# Altium schematic sheet tempmux.SchDoc
size A
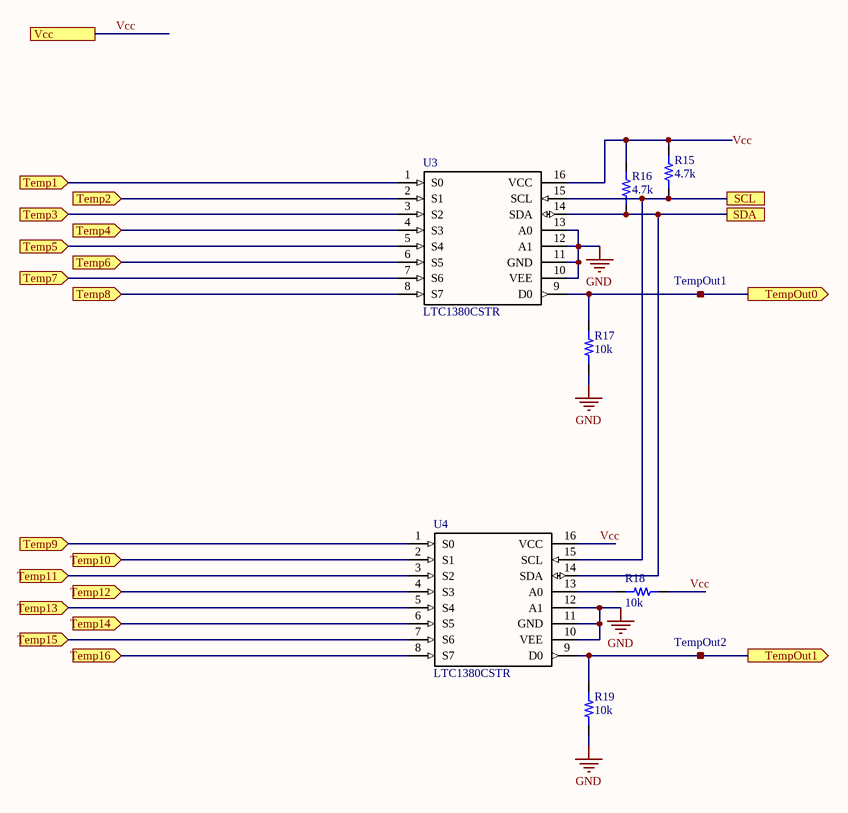
[diagram p0: tempmux.SchDoc]

## Parts
R15  4.7k  [RES 0603/1608]
R16  4.7k  [RES 0603/1608]
R17  10k  [RES 0603/1608]
R18  10k  [RES 0603/1608]
R19  10k  [RES 0603/1608]
TempOut1  RCU-0C  [RCU-0C]  (value not drawn)
TempOut2  RCU-0C  [RCU-0C]  (value not drawn)
U3  LTC1380CSTR  [LTC1380CSTR]
U4  LTC1380CSTR  [LTC1380CSTR]

## Ports
SCL, SDA, Temp1 (in), Temp2 (in), Temp3 (in), Temp4 (in), Temp5 (in), Temp6 (in), Temp7 (in), Temp8 (in), Temp9 (in), Temp10 (in), Temp11 (in), Temp12 (in), Temp13 (in), Temp14 (in), Temp15 (in), Temp16 (in), TempOut0 (out), TempOut1 (out), Vcc

## Nets
GND: R17.1 R19.1 U3.10(VEE) U3.11(GND) U3.12(A1) U3.13(A0) U4.10(VEE) U4.11(GND) U4.12(A1)
SCL: R15.1 U3.15(SCL) U4.15(SCL) ; port SCL
SDA: R16.1 U3.14(SDA) U4.14(SDA) ; port SDA
Temp1: U3.1(S0) ; port Temp1
Temp2: U3.2(S1) ; port Temp2
Temp3: U3.3(S2) ; port Temp3
Temp4: U3.4(S3) ; port Temp4
Temp5: U3.5(S4) ; port Temp5
Temp6: U3.6(S5) ; port Temp6
Temp7: U3.7(S6) ; port Temp7
Temp8: U3.8(S7) ; port Temp8
Temp9: U4.1(S0) ; port Temp9
Temp10: U4.2(S1) ; port Temp10
Temp11: U4.3(S2) ; port Temp11
Temp12: U4.4(S3) ; port Temp12
Temp13: U4.5(S4) ; port Temp13
Temp14: U4.6(S5) ; port Temp14
Temp15: U4.7(S6) ; port Temp15
Temp16: U4.8(S7) ; port Temp16
TempOut0: R17.2 TempOut1.1 U3.9(D0) ; port TempOut0
TempOut1: R19.2 TempOut2.1 U4.9(D0) ; port TempOut1
Vcc: R15.2 R16.2 R18.2 U3.16(VCC) U4.16(VCC) ; port Vcc
NetR18_1: R18.1 U4.13(A0)

## Library data of the parts
R15-R19 = 1: id: 1; name: 0603 Resistor; percent tolerance: 5; package: 0603; quantity: 0
  R15 R16: resistance: 4.7k
  R17-R19: resistance: 10k
TempOut1 TempOut2 = 14: id: 14; numcontacts: 1; name: RCU-0C; numrows: 1; quantity: 0; link: https://www.digikey.com/product-detail/en/te-connectivity-amp-connectors/RCU-0C/A106145CT-ND/3477802
U3 U4 = 39: 8:1 analog multiplexer. I2C interface. 2 address pins.; id: 39; vcc: 5; updatedby: 0; name: LTC1380; voltageinmax: 5; package: SOIC-16; quantity: 0; link: https://www.mouser.com/ProductDetail/Analog-Devices-Linear-Technology/LTC1380CSTR?qs=hVkxg5c3xu%2Flgahs8%252BvvEA%3D%3D; createdby: Haley Pierce